# EAGLE board A-14732-40023-REPRODUCTION (EAGLE 7.4.0), part 1 of 2
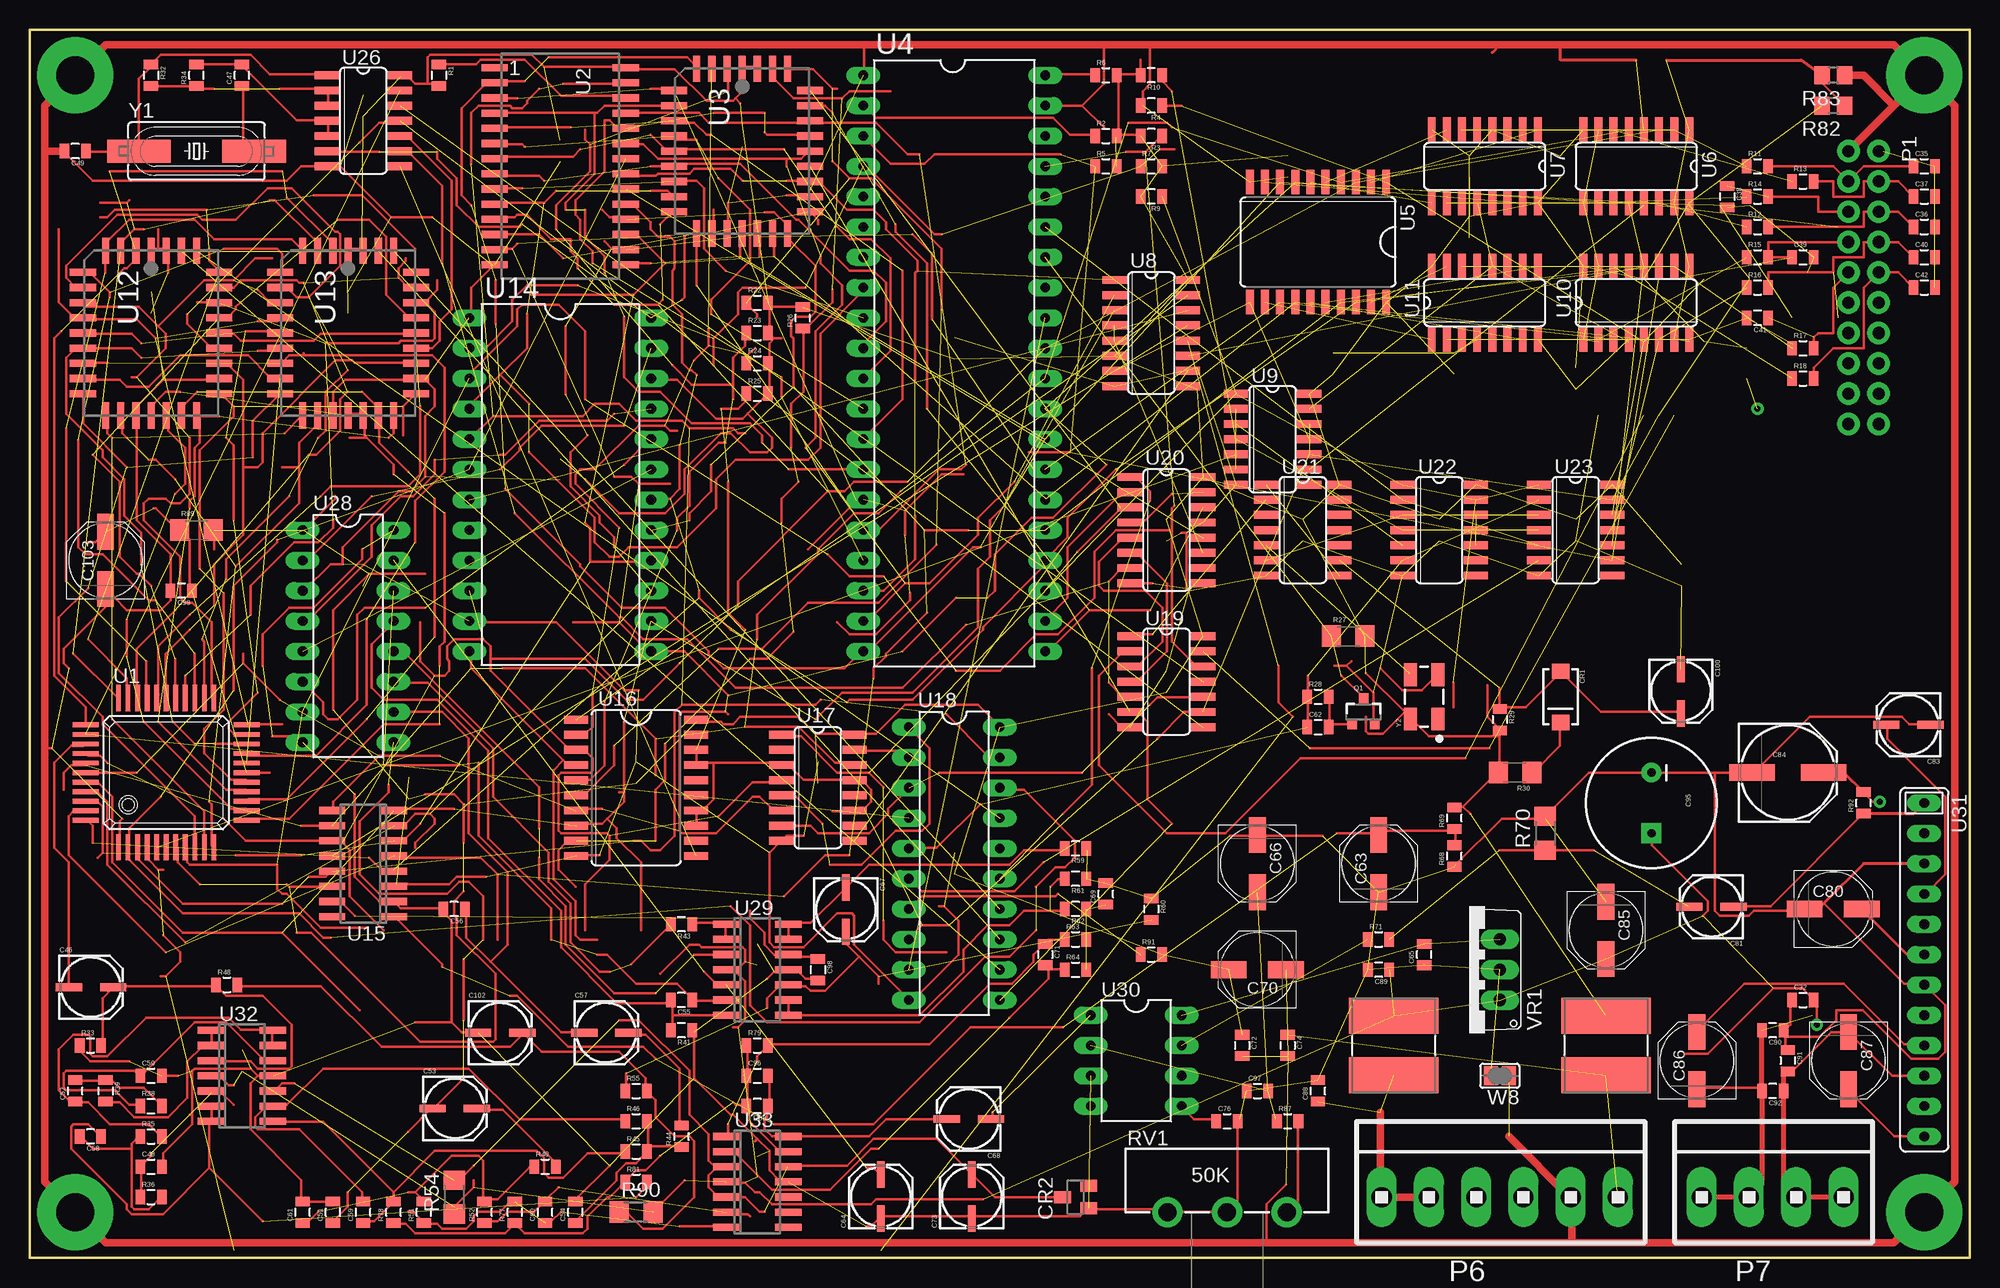
[diagram p4: board, top side]
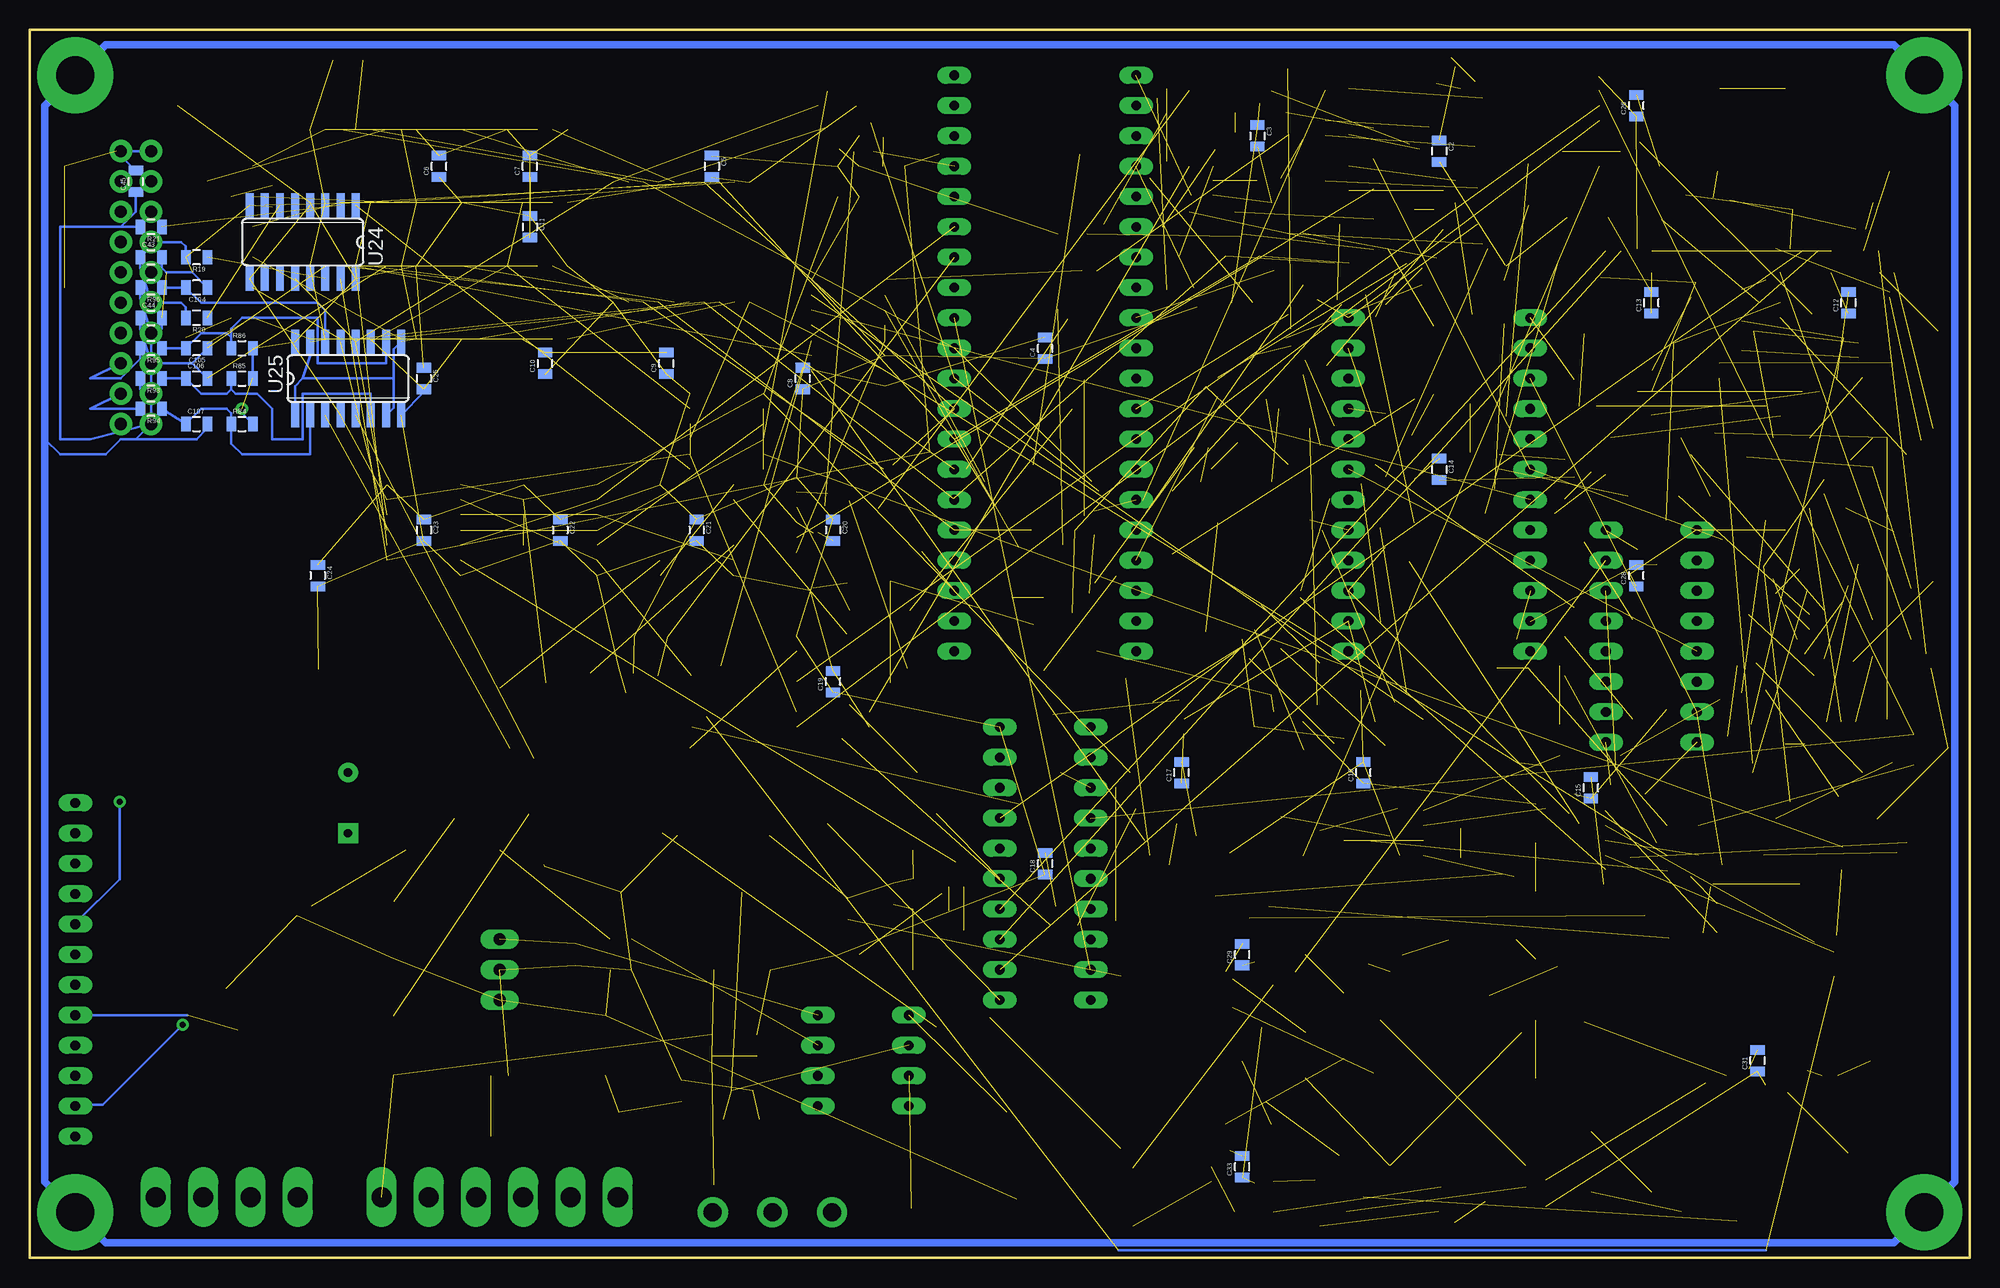
[diagram p5: board, bottom side, seen from below]

Size 162.56 x 102.87 mm. Coordinates in mm from the lower left corner, seen from the top.
Outline: 0,0 162.56,0 162.56,102.87 0,102.87 0,0
Copper layers (1*16): Top 0.035mm / dielectric 1.5mm / Bottom 0.035mm
Design rules "SparkFun": minimum track width 8mil, minimum drill 20mil, track to track 8mil, track to pad 8mil, pad to pad 8mil, via to via 8mil, smd to smd 8mil, copper to edge 10mil, drill to drill 8mil, minimum pad ring 12mil, minimum via ring 10mil, stop-mask expansion 4mil, vias tented up to drill 25mil, thermal gap 10mil

## Footprints (pad centres in the part's own frame; a part is rotated, then mirrored left to right if it is on the bottom)
0805 = smd 0.8 x 1.2: 1 -0.9,0; 2 0.9,0
PANASONIC_C = smd 2.2 x 0.65: + 1.9,-0.2; - -1.8,-0.2
PANASONIC_D = smd 3 x 1.4: + 2.4,0; - -2.4,0
PANASONIC_E = smd 3.8 x 1.4: + 3,0; - -3,0
CPOL-RADIAL-1000UF-25V = drill 0.7 pad 1.651 square: 1 2.54,0 | drill 0.7 pad 1.651: 2 -2.54,0
SMA-DIODE = smd 1.27 x 1.47: A -2.15,0; C 2.15,0
SOT23 = smd 1 x 1.4: 1 -0.95,-1.1; 2 0.95,-1.1; 3 0,1.1
NPI75C = smd 3 x 7.5: 1 -2.5,0; 2 2.5,0
STANDOFF-ELECTRICAL = drill 3.2 pad 6.35: P1 0,0
2X10_ROUND_NOSILK = drill 1.016 pad 1.88: 1 -11.43,-1.27; 2 -11.43,1.27; 3 -8.89,-1.27; 4 -8.89,1.27; 5 -6.35,-1.27; 6 -6.35,1.27; 7 -3.81,-1.27; 8 -3.81,1.27; 9 -1.27,-1.27; 10 -1.27,1.27; 11 1.27,-1.27; 12 1.27,1.27; 13 3.81,-1.27; 14 3.81,1.27; 15 6.35,-1.27; 16 6.35,1.27; 17 8.89,-1.27; 18 8.89,1.27; 19 11.43,-1.27; 20 11.43,1.27
1X6MTA = drill 1.676 long: 1 9.906,0; 2 5.944,0; 3 1.981,0; 4 -1.981,0; 5 -5.944,0; 6 -9.906,0
1X4MTA = drill 1.676 long: 1 5.944,0; 2 1.981,0; 3 -1.981,0; 4 -5.944,0
SOT23-3 = smd 0.8 x 0.9: 1 -0.95,-1; 2 0.95,-1; 3 0,1.1
1206 = smd 1.6 x 1.8: 1 -1.4,0; 2 1.4,0
R1206 = smd 1.6 x 1.803: 1 -1.422,0; 2 1.422,0
R0805 = smd 1.3 x 1.5: 1 -0.95,0; 2 0.95,0
POT_ALPHA_RV16AF-20 = drill 1.5 pad 2.54: 1 -5,0; 2 0,0; 3 5,0
QFP44 = smd 0.4 x 2.2: 1 -4,-6.25; 2 -3.2,-6.25; 3 -2.4,-6.25; 4 -1.6,-6.25; 5 -0.8,-6.25; 6 0,-6.25; 7 0.8,-6.25; 8 1.6,-6.25; 9 2.4,-6.24; 10 3.2,-6.25; 11 4,-6.25; 23 4,6.25; 24 3.2,6.25; 25 2.4,6.26; 26 1.6,6.25; 27 0.8,6.25; 28 0,6.25; 29 -0.8,6.25; 30 -1.6,6.25; 31 -2.4,6.25; 32 -3.2,6.25; 33 -4,6.25 | smd 2.2 x 0.4: 12 6.75,-4; 13 6.75,-3.2; 14 6.75,-2.4; 15 6.75,-1.6; 16 6.75,-0.8; 17 6.75,0; 18 6.75,0.8; 19 6.75,1.6; 20 6.74,2.4; 21 6.75,3.2; 22 6.75,4; 34 -6.75,4; 35 -6.75,3.2; 36 -6.76,2.4; 37 -6.75,1.6; 38 -6.75,0.8; 39 -6.75,0; 40 -6.75,-0.8; 41 -6.75,-1.6; 42 -6.75,-2.4; 43 -6.75,-3.2; 44 -6.75,-4
SOP28 = smd 0.6 x 2.2: 1 -8.255,-5.5; 2 -6.985,-5.5; 3 -5.715,-5.5; 4 -4.445,-5.5; 5 -3.175,-5.5; 6 -1.905,-5.5; 7 -0.635,-5.5; 8 0.635,-5.5; 9 1.905,-5.5; 10 3.175,-5.5; 11 4.445,-5.5; 12 5.715,-5.5; 13 6.985,-5.5; 14 8.255,-5.5; 15 8.255,5.5; 16 6.985,5.5; 17 5.715,5.5; 18 4.445,5.5; 19 3.175,5.5; 20 1.905,5.5; 21 0.635,5.5; 22 -0.635,5.5; 23 -1.905,5.5; 24 -3.175,5.5; 25 -4.445,5.5; 26 -5.715,5.5; 27 -6.985,5.5; 28 -8.255,5.5
PLCC32R = smd 0.6 x 2.2: 1 0,6.9; 2 -1.27,6.9; 3 -2.54,6.9; 4 -3.81,6.9; 14 -3.81,-6.9; 15 -2.54,-6.9; 16 -1.27,-6.9; 17 0,-6.9; 18 1.27,-6.9; 19 2.54,-6.9; 20 3.81,-6.9; 30 3.81,6.9; 31 2.54,6.9; 32 1.27,6.9 | smd 2.2 x 0.6: 5 -5.7,5.08; 6 -5.7,3.81; 7 -5.7,2.54; 8 -5.7,1.27; 9 -5.7,0; 10 -5.7,-1.27; 11 -5.7,-2.54; 12 -5.7,-3.81; 13 -5.7,-5.08; 21 5.7,-5.08; 22 5.7,-3.81; 23 5.7,-2.54; 24 5.7,-1.27; 25 5.7,0; 26 5.7,1.27; 27 5.7,2.54; 28 5.7,3.81; 29 5.7,5.08
DIP40 = drill 0.813 long: 1 -24.13,-7.62; 2 -21.59,-7.62; 3 -19.05,-7.62; 4 -16.51,-7.62; 5 -13.97,-7.62; 6 -11.43,-7.62; 7 -8.89,-7.62; 8 -6.35,-7.62; 9 -3.81,-7.62; 10 -1.27,-7.62; 11 1.27,-7.62; 12 3.81,-7.62; 13 6.35,-7.62; 14 8.89,-7.62; 15 11.43,-7.62; 16 13.97,-7.62; 17 16.51,-7.62; 18 19.05,-7.62; 19 21.59,-7.62; 20 24.13,-7.62; 21 24.13,7.62; 22 21.59,7.62; 23 19.05,7.62; 24 16.51,7.62; 25 13.97,7.62; 26 11.43,7.62; 27 8.89,7.62; 28 6.35,7.62; 29 3.81,7.62; 30 1.27,7.62; 31 -1.27,7.62; 32 -3.81,7.62; 33 -6.35,7.62; 34 -8.89,7.62; 35 -11.43,7.62; 36 -13.97,7.62; 37 -16.51,7.62; 38 -19.05,7.62; 39 -21.59,7.62; 40 -24.13,7.62
SO20W = smd 0.66 x 2.032: 1 -5.715,-5.029; 2 -4.445,-5.029; 3 -3.175,-5.029; 4 -1.905,-5.029; 5 -0.635,-5.029; 6 0.635,-5.029; 7 1.905,-5.029; 8 3.175,-5.029; 9 4.445,-5.029; 10 5.715,-5.029; 11 5.715,5.029; 12 4.445,5.029; 13 3.175,5.029; 14 1.905,5.029; 15 0.635,5.029; 16 -0.635,5.029; 17 -1.905,5.029; 18 -3.175,5.029; 19 -4.445,5.029; 20 -5.715,5.029
SO16 = smd 0.66 x 2.032: 1 -4.445,-3.073; 2 -3.175,-3.073; 3 -1.905,-3.073; 4 -0.635,-3.073; 5 0.635,-3.073; 6 1.905,-3.073; 7 3.175,-3.073; 8 4.445,-3.073; 9 4.445,3.073; 10 3.175,3.073; 11 1.905,3.073; 12 0.635,3.073; 13 -0.635,3.073; 14 -1.905,3.073; 15 -3.175,3.073; 16 -4.445,3.073
SO14 = smd 0.66 x 2.032: 1 -3.81,-3.073; 2 -2.54,-3.073; 3 -1.27,-3.073; 4 0,-3.073; 5 1.27,-3.073; 6 2.54,-3.073; 7 3.81,-3.073; 8 3.81,3.073; 9 2.54,3.073; 10 1.27,3.073; 11 0,3.073; 12 -1.27,3.073; 13 -2.54,3.073; 14 -3.81,3.073
DIP24 = drill 0.813 long: 1 -13.97,-7.62; 2 -11.43,-7.62; 3 -8.89,-7.62; 4 -6.35,-7.62; 5 -3.81,-7.62; 6 -1.27,-7.62; 7 1.27,-7.62; 8 3.81,-7.62; 9 6.35,-7.62; 10 8.89,-7.62; 11 11.43,-7.62; 12 13.97,-7.62; 13 13.97,7.62; 14 11.43,7.62; 15 8.89,7.62; 16 6.35,7.62; 17 3.81,7.62; 18 1.27,7.62; 19 -1.27,7.62; 20 -3.81,7.62; 21 -6.35,7.62; 22 -8.89,7.62; 23 -11.43,7.62; 24 -13.97,7.62
SOIC16N = smd 0.6 x 2.2: 1 -4.445,-2.6; 2 -3.175,-2.6; 3 -1.905,-2.6; 4 -0.635,-2.6; 5 0.635,-2.6; 6 1.905,-2.6; 7 3.175,-2.6; 8 4.445,-2.6; 9 4.445,2.6; 10 3.175,2.6; 11 1.905,2.6; 12 0.635,2.6; 13 -0.635,2.6; 14 -1.905,2.6; 15 -3.175,2.6; 16 -4.445,2.6
DIP20N = drill 0.813 long: 1 -11.43,-3.81; 2 -8.89,-3.81; 3 -6.35,-3.81; 4 -3.81,-3.81; 5 -1.27,-3.81; 6 1.27,-3.81; 7 3.81,-3.81; 8 6.35,-3.81; 9 8.89,-3.81; 10 11.43,-3.81; 11 11.43,3.81; 12 8.89,3.81; 13 6.35,3.81; 14 3.81,3.81; 15 1.27,3.81; 16 -1.27,3.81; 17 -3.81,3.81; 18 -6.35,3.81; 19 -8.89,3.81; 20 -11.43,3.81
DIP16N = drill 0.813 long: 1 -8.89,-3.81; 2 -6.35,-3.81; 3 -3.81,-3.81; 4 -1.27,-3.81; 5 1.27,-3.81; 6 3.81,-3.81; 7 6.35,-3.81; 8 8.89,-3.81; 9 8.89,3.81; 10 6.35,3.81; 11 3.81,3.81; 12 1.27,3.81; 13 -1.27,3.81; 14 -3.81,3.81; 15 -6.35,3.81; 16 -8.89,3.81
SO14' = smd 0.6 x 2.2: 1 -3.81,-2.6; 2 -2.54,-2.6; 3 -1.27,-2.6; 4 0,-2.6; 5 1.27,-2.6; 6 2.54,-2.6; 7 3.81,-2.6; 8 3.81,2.6; 9 2.54,2.6; 10 1.27,2.6; 11 0,2.6; 12 -1.27,2.6; 13 -2.54,2.6; 14 -3.81,2.6
MC3340 = drill 0.813 long: 1 -3.81,-3.81; 2 -1.27,-3.81; 3 1.27,-3.81; 4 3.81,-3.81; 5 3.81,3.81; 6 1.27,3.81; 7 -1.27,3.81; 8 -3.81,3.81
SIP12 = drill 0.813 long: 1 -10.16,0; 2 -7.62,0; 3 -5.08,0; 4 -2.54,0; 5 0,0; 6 2.54,0; 7 5.08,0; 8 7.62,0; 9 10.16,0; 10 12.7,0; 11 15.24,0; 12 17.78,0
7809-TO220V = drill 1.016 long: 1 -2.54,-2.54; 2 0,-2.54; 3 2.54,-2.54
SJ = smd 1.168 x 1.6: 1 -0.762,0; 2 0.762,0
HC49UP = smd 5.334 x 1.93: 1 -4.826,0; 2 4.826,0
CRYSTAL-OSC-SMD-5X3 = smd 1.9 x 1.1: 1 -1.85,-1.15; 2 1.85,-1.15; 3 1.85,1.15; 4 -1.85,1.15

## Placement (x,y rotation side)
C2  .01uF  [0805]  44.45,92.71 270 bottom
C3  .01uF  [0805]  59.69,93.98 270 bottom
C4  .01uF  [0805]  77.47,76.2 90 bottom
C5  .01uF  [0805]  105.41,91.44 270 bottom
C6  .01uF  [0805]  128.27,91.44 90 bottom
C7  .01uF  [0805]  120.65,91.44 90 bottom
C8  .01uF  [0805]  97.79,73.66 90 bottom
C9  .01uF  [0805]  109.22,74.93 90 bottom
C10  .01uF  [0805]  119.38,74.93 90 bottom
C11  .01uF  [0805]  120.65,86.36 270 bottom
C12  .01uF  [0805]  10.16,80.01 90 bottom
C13  .01uF  [0805]  26.67,80.01 90 bottom
C14  .01uF  [0805]  44.45,66.04 270 bottom
C15  .01uF  [0805]  31.75,39.37 90 bottom
C16  .01uF  [0805]  50.8,40.64 90 bottom
C17  .01uF  [0805]  66.04,40.64 90 bottom
C18  .01uF  [0805]  77.47,33.02 90 bottom
C19  .01uF  [0805]  95.25,48.26 90 bottom
C20  .01uF  [0805]  95.25,60.96 270 bottom
C21  .01uF  [0805]  106.68,60.96 270 bottom
C22  .01uF  [0805]  118.11,60.96 270 bottom
C23  .01uF  [0805]  129.54,60.96 270 bottom
C24  .01uF  [0805]  138.43,57.15 270 bottom
C25  .01uF  [0805]  129.54,73.66 270 bottom
C26  .01uF  [0805]  27.94,96.52 90 bottom
C28  .01uF  [0805]  27.94,57.15 90 bottom
C29  .01uF  [0805]  60.96,25.4 90 bottom
C31  .01uF  [0805]  17.78,16.51 90 bottom
C32  .01uF  [0805]  148.59,21.59 0 top
C33  .01uF  [0805]  60.96,7.62 90 bottom
C35  100pF  [0805]  158.75,91.44 0 top
C36  100pF  [0805]  158.75,86.36 0 top
C37  100pF  [0805]  158.75,88.9 0 top
C38  100pF  [0805]  142.24,88.9 270 top
C39  100pF  [0805]  148.59,83.82 0 top
C40  100pF  [0805]  158.75,83.82 0 top
C41  100pF  [0805]  144.78,78.74 180 top
C42  100pF  [0805]  158.75,81.28 0 top
C43  100pF  [0805]  152.4,83.82 0 bottom
C44  100pF  [0805]  152.4,78.74 0 bottom
C45  100pF  [0805]  153.67,90.17 90 bottom
C46  10uF  [PANASONIC_C]  5.08,22.86 0 top
C47  100pF  [0805]  17.78,99.06 90 top
C48  3.3nF  [0805]  10.16,7.62 0 top
C49  100pF  [0805]  3.81,92.71 180 top
C50  3.3nF  [0805]  10.16,15.24 0 top
C51  3.3nF  [0805]  25.4,3.81 90 top
C52  6.8nF  [0805]  3.81,13.97 90 top
C53  10uF  [PANASONIC_C]  35.56,12.7 0 top
C54  220pF  [0805]  45.72,3.81 90 top
C55  .001uF  [0805]  54.61,21.59 180 top
C56  3.3nF  [0805]  35.56,29.21 180 top
C57  10uF  [PANASONIC_C]  48.26,19.05 0 top
C58  6.8nF  [0805]  5.08,10.16 180 top
C59  33pF  [0805]  27.94,3.81 90 top
C60  33pF  [0805]  43.18,3.81 90 top
C61  220pF  [0805]  22.86,3.81 90 top
C62  68pF  [0805]  107.95,44.45 0 top
C63  47uF  [PANASONIC_D]  113.03,33.02 90 top
C64  10uF  [PANASONIC_C]  71.12,5.08 90 top
C65  0.22uF  [0805]  116.84,25.4 90 top
C66  47uF  [PANASONIC_D]  102.87,33.02 270 top
C67  10uF  [PANASONIC_C]  68.58,29.21 270 top
C68  1uF  [PANASONIC_C]  78.74,11.43 180 top
C69  2.2nF  [0805]  90.17,30.48 90 top
C70  100uF  [PANASONIC_D]  102.87,24.13 180 top
C71  470pF  [0805]  85.09,25.4 270 top
C72  0.1uF  [0805]  101.6,17.78 270 top
C73  10uF  [PANASONIC_C]  78.74,5.08 90 top
C74  0.1uF  [0805]  105.41,17.78 270 top
C76  .001uF  [0805]  100.33,11.43 0 top
C80  47uF  [PANASONIC_D]  151.13,29.21 0 top
C81  10uF  [PANASONIC_C]  140.97,29.21 180 top
C83  10uF  [PANASONIC_C]  157.48,44.45 180 top
C84  220uF  [PANASONIC_E]  147.32,40.64 0 top
C85  100uF  [PANASONIC_D]  132.08,27.43 270 top
C86  100uF  [PANASONIC_D]  139.7,16.51 90 top
C87  100uF  [PANASONIC_D]  152.4,16.51 270 top
C88  0.1uF  [0805]  107.95,13.97 90 top
C89  0.1uF  [0805]  113.03,24.13 180 top
C90  0.1uF  [0805]  146.05,19.05 180 top
C91  0.1uF  [0805]  147.32,16.51 270 top
C92  0.1uF  [0805]  146.05,13.97 180 top
C95  2200uF  [CPOL-RADIAL-1000UF-25V]  135.89,38.1 270 top
C96  220pF  [0805]  60.96,15.24 0 top
C97  .01uF  [0805]  102.87,13.97 0 top
C98  100pF  [0805]  66.04,24.13 270 top
C99  0.01uF  [0805]  12.7,55.88 180 top
C100  10uF  [PANASONIC_C]  138.56,47.5 270 top
C102  10uF  [PANASONIC_C]  39.37,19.05 0 top
C103  100uF  [PANASONIC_D]  6.35,58.42 90 top
C104  100pF  [0805]  148.59,81.28 180 bottom
C105  100pF  [0805]  148.59,76.2 180 bottom
C106  100pF  [0805]  148.59,73.66 0 bottom
C107  100pF  [0805]  148.59,69.85 0 bottom
CR1  1N4148  [SMA-DIODE]  128.27,46.99 270 top
CR2  1N5232  [SOT23]  87.63,5.08 90 top
L1  4.7uH  [NPI75C]  132.08,17.78 270 top
L2  4.7uH  [NPI75C]  114.3,17.78 90 top
MTG1  MTGHOLE  [STANDOFF-ELECTRICAL]  158.75,3.81 0 top
MTG2  MTGHOLE  [STANDOFF-ELECTRICAL]  3.81,3.81 0 top
MTG3  MTGHOLE  [STANDOFF-ELECTRICAL]  158.75,99.06 0 top
MTG4  MTGHOLE  [STANDOFF-ELECTRICAL]  3.81,99.06 0 top
P1  [2X10_ROUND_NOSILK]  153.67,81.28 270 top
P6  POWER  [1X6MTA]  123.19,5.08 0 top
P7  SPEAKER  [1X4MTA]  146.05,5.08 0 top
Q1  MPS3646  [SOT23-3]  111.76,45.72 0 top
R1  4.7K  [0805]  34.29,99.06 270 top
R2  4.7K  [0805]  90.17,93.98 0 top
R3  4.7K  [0805]  93.98,93.98 180 top
R4  100  [0805]  93.98,96.52 180 top
R5  4.7K  [0805]  90.17,91.44 0 top
R6  4.7K  [0805]  90.17,99.06 0 top
R7  4.7K  [0805]  93.98,91.44 0 top
R9  4.7K  [0805]  93.98,88.9 180 top
R10  4.7K  [0805]  93.98,99.06 180 top
R11  47  [0805]  144.78,91.44 0 top
R12  47  [0805]  144.78,86.36 0 top
R13  47  [0805]  148.59,90.17 0 top
R14  47  [0805]  144.78,88.9 0 top
R15  47  [0805]  144.78,83.82 0 top
R16  47  [0805]  144.78,81.28 0 top
R17  47  [0805]  148.59,76.2 0 top
R18  47  [0805]  148.59,73.66 0 top
R19  47  [0805]  148.59,83.82 180 bottom
R20  47  [0805]  148.59,78.74 180 bottom
R21  47  [0805]  152.4,86.36 180 bottom
R22  2.2K  [0805]  60.96,80.01 0 top
R23  2.2K  [0805]  60.96,77.47 0 top
R24  2.2K  [0805]  60.96,74.93 0 top
R25  4.7K  [0805]  60.96,72.39 0 top
R26  2.2K  [0805]  64.77,78.74 90 top
R27  150  [1206]  110.49,52.07 0 top
R28  3.3K  [0805]  107.95,46.99 0 top
R29  47K  [0805]  123.19,45.09 270 top
R30  100  [1206]  124.46,40.64 180 top
R32  470  [0805]  10.16,99.06 270 top
R33  100K  [0805]  5.08,17.78 0 top
R34  470  [0805]  13.97,99.06 90 top
R35  10K  [0805]  10.16,10.16 0 top
R36  10K  [0805]  10.16,5.08 0 top
R38  10K  [0805]  10.16,12.7 0 top
R39  10K  [0805]  6.35,13.97 270 top
R40  150K  [0805]  43.18,7.62 0 top
R41  470  [0805]  54.61,19.05 180 top
R43  1K  [0805]  54.61,27.94 180 top
R44  150K  [0805]  54.61,10.16 90 top
R45  62K  [0805]  50.8,8.89 0 top
R46  150K  [0805]  50.8,11.43 0 top
R48  100K  [0805]  16.51,22.86 0 top
R51  62K  [0805]  33.02,3.81 90 top
R52  150K  [0805]  38.1,3.81 90 top
R54  200  [R1206]  35.56,5.08 90 top
R55  100K  [0805]  50.8,13.97 0 top
R59  2.2K  [0805]  87.63,34.29 180 top
R60  100K  [0805]  93.98,29.21 270 top
R61  2.2K  [0805]  87.63,31.75 180 top
R62  10K  [0805]  87.63,29.21 180 top
R63  10K  [0805]  87.63,26.67 0 top
R64  12K  [0805]  87.63,24.13 0 top
R68  1K  [0805]  119.38,33.66 90 top
R69  8.2K  [0805]  119.38,36.83 90 top
R70  47  [R1206]  127,35.56 90 top
R71  10K  [0805]  113.03,26.67 0 top
R77  56K  [0805]  40.64,3.81 90 top
R78  56K  [0805]  30.48,3.81 90 top
R79  82K  [0805]  60.96,17.78 0 top
R81  47K  [0805]  50.8,6.35 0 top
R82  220  [R0805]  151.13,96.52 180 top
R83  470  [R0805]  151.13,99.06 180 top
R84  4.7K  [0805]  144.78,69.85 0 bottom
R85  4.7K  [0805]  144.78,73.66 0 bottom
R86  4.7K  [0805]  144.78,76.2 0 bottom
R87  3.9K  [0805]  105.41,11.43 0 top
R88  27K  [0805]  60.96,12.7 180 top
R89  10  [1206]  13.97,60.96 0 top
R90  100  [R1206]  50.8,3.81 0 top
R91  4.7K  [0805]  93.98,25.4 0 top
R92  100K  [0805]  153.67,38.1 90 top
R93  47  [0805]  152.4,73.66 180 bottom
R94  47  [0805]  152.4,71.12 180 bottom
R95  47  [0805]  152.4,76.2 180 bottom
R96  47  [0805]  152.4,81.28 180 bottom
RV1  50K  [POT_ALPHA_RV16AF-20]  100.33,3.81 0 top
U1  OKI6295  [QFP44]  11.43,40.64 0 top
U2  2064  [SOP28]  44.45,91.44 270 top
U3  27C040  [PLCC32R]  59.69,92.71 0 top
U4  6809E  [DIP40]  77.47,74.93 270 top
U5  74LS374DW  [SO20W]  107.95,85.09 180 top
U6  26LS32A  [SO16]  134.62,91.44 180 top
U7  26LS31  [SO16]  121.92,91.44 180 top
U8  74LS138  [SO16]  93.98,77.47 270 top
U9  74LS74  [SO14]  104.14,68.58 270 top
U10  26LS32A  [SO16]  134.62,80.01 0 top
U11  26LS31  [SO16]  121.92,80.01 0 top
U12  27C040-150  [PLCC32R]  10.16,77.47 0 top
U13  27C040-150  [PLCC32R]  26.67,77.47 0 top
U14  YAMAHA 2151  [DIP24]  44.45,64.77 270 top
U15  TIL7524  [SOIC16N]  27.94,33.02 90 top
U16  74LS374  [SO20W]  50.8,39.37 270 top
U17  74LS174  [SO16]  66.04,39.37 270 top
U18  16L8  [DIP20N]  77.47,33.02 270 top
U19  74LS11  [SO14]  95.25,48.26 270 top
U20  74LS139  [SO16]  95.25,60.96 270 top
U21  74LS14  [SO14]  106.68,60.96 270 top
U22  74LS74  [SO14]  118.11,60.96 270 top
U23  74LS74  [SO14]  129.54,60.96 270 top
U24  26LS31  [SO16]  139.7,85.09 180 bottom
U25  26LS32A  [SO16]  135.89,73.66 0 bottom
U26  74LS04  [SO14]  27.94,95.25 270 top
U28  YAMAHA 3012  [DIP16N]  26.67,52.07 270 top
U29  LM324D  [SO14']  60.96,24.13 270 top
U30  MC3340  [MC3340]  92.71,16.51 270 top
U31  MB3731  [SIP12]  158.75,27.94 270 top
U32  TL084D  [SO14']  17.78,15.24 270 top
U33  TL084D  [SO14']  60.96,6.35 270 top
VR1  7809  [7809-TO220V]  120.65,24.13 90 top
W8  JUMPER  [SJ]  123.19,15.24 180 top
Y1  3.5749MHz  [HC49UP]  13.97,92.71 0 top
Y2  8MHz  [CRYSTAL-OSC-SMD-5X3]  116.84,46.99 90 top